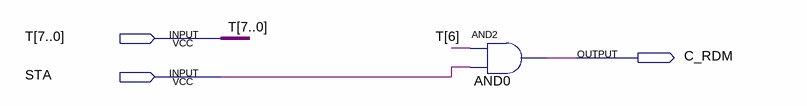
[diagram p0: schematic sheet]
// Quartus schematic C_RDM.bdf as structural Verilog: 1 symbols, 3 pins
module C_RDM (
  input  [7:0] T,
  input  STA,
  output C_RDM
);

  and AND0 (C_RDM, T[6], STA);
endmodule
